# Altium schematic sheet ECG_Schematic.SchDoc
size A4; SheetNumber: 2; SheetTotal: 2
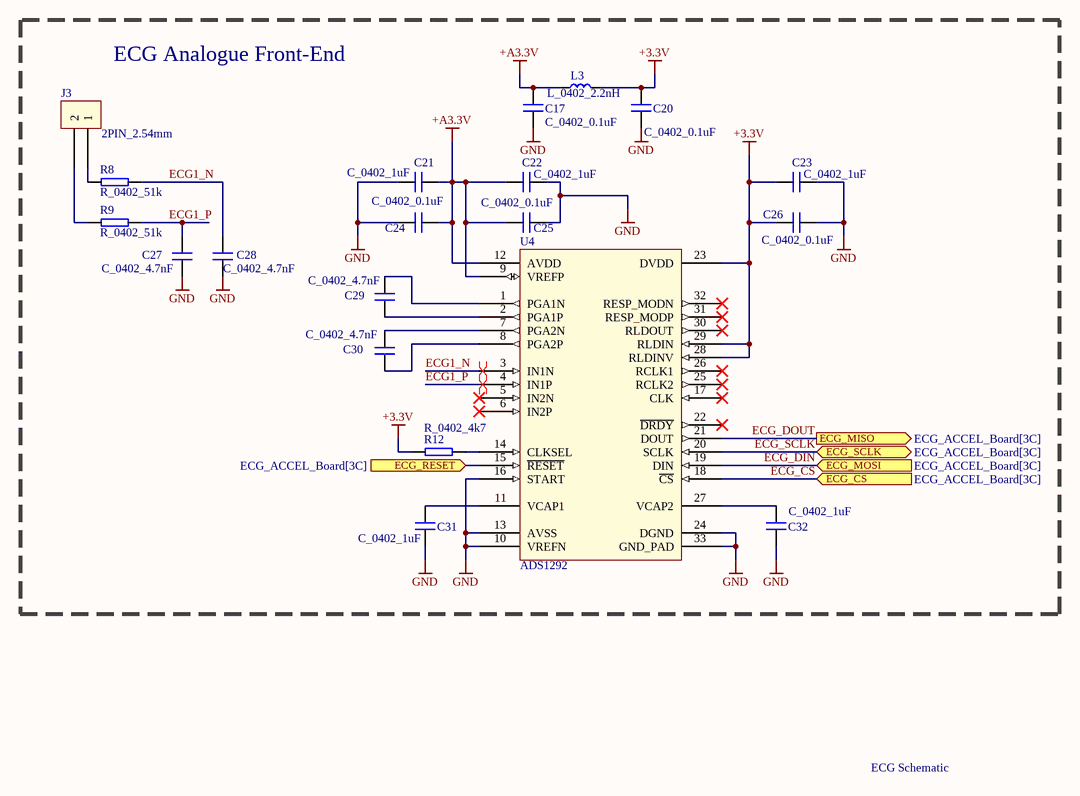
[diagram p0: ECG_Schematic.SchDoc]

## Parts
C17  C_0402_0.1uF  [C_0402]
C20  C_0402_0.1uF  [C_0402]
C21  C_0402_1uF  [C_0402]
C22  C_0402_1uF  [C_0402]
C23  C_0402_1uF  [C_0402]
C24  C_0402_0.1uF  [C_0402]
C25  C_0402_0.1uF  [C_0402]
C26  C_0402_0.1uF  [C_0402]
C27  C_0402_4.7nF  [C_0402]
C28  C_0402_4.7nF  [C_0402]
C29  C_0402_4.7nF  [C_0402]
C30  C_0402_4.7nF  [C_0402]
C31  C_0402_1uF  [C_0402]
C32  C_0402_1uF  [C_0402]
J3  2PIN_2.54mm  [2PIN_2.54mm-Footprint-1]
L3  L_0402_2.2nH  [L_0402]
R8  R_0402_51k  [R_0402]
R9  R_0402_51k  [R_0402]
R12  R_0402_4k7  [R_0402]
U4  ADS1292  [QFN127P600-8N]

## Blocks framed on the sheet
ECG Analogue Front-End: C17 C20-C32 J3 L3 R8 R9 R12 U4

## Ports
ECG_CS (in, see ECG_ACCEL_Board[3C]), ECG_MISO (out, see ECG_ACCEL_Board[3C]), ECG_MOSI (in, see ECG_ACCEL_Board[3C]), ECG_RESET (in, see ECG_ACCEL_Board[3C]), ECG_SCLK (bidir, see ECG_ACCEL_Board[3C])

## Nets
+3.3V: C20.2 C23.1 C26.1 L3.2 R12.2 U4.23(DVDD) U4.28(RLDINV) U4.29(RLDIN)
+A3.3V: C17.2 C21.2 C22.2 C24.2 C25.2 L3.1 U4.9(VREFP) U4.12(AVDD)
GND: C17.1 C20.1 C21.1 C22.1 C23.2 C24.1 C25.1 C26.2 C27.1 C28.1 C31.1 C32.1 U4.10(VREFN) U4.13(AVSS) U4.16(START) U4.24(DGND) U4.33(GND_PAD)
ECG1_N: C28.2 R8.1 U4.3(IN1N)
ECG1_P: C27.2 R9.1 U4.4(IN1P)
ECG_CS: U4.18(~{CS}) ; port ECG_CS
ECG_DIN: U4.19(DIN) ; port ECG_MOSI
ECG_DOUT: U4.21(DOUT) ; port ECG_MISO
ECG_RESET: U4.15(~{RESET}) ; port ECG_RESET
ECG_SCLK: U4.20(SCLK) ; port ECG_SCLK
NetC29_1: C29.1 U4.2(PGA1P)
NetC29_2: C29.2 U4.1(PGA1N)
NetC30_1: C30.1 U4.8(PGA2P)
NetC30_2: C30.2 U4.7(PGA2N)
NetC31_2: C31.2 U4.11(VCAP1)
NetC32_2: C32.2 U4.27(VCAP2)
NetJ3_1: J3.1 R8.2
NetJ3_2: J3.2 R9.2
NetR12_1: R12.1 U4.14(CLKSEL)

Not connected (* = marked no-connect by the designer): U4 5(IN2N)* 6(IN2P)* 17(CLK)* 22(~{DRDY})* 25(RCLK2)* 26(RCLK1)* 30(RLDOUT)* 31(RESP_MODP)* 32(RESP_MODN)*

## Layout directives
differential pair: ECG1_N, ECG1_P

## Notes on the sheet
- ECG Schematic

## Library data of the parts
C17 C20 C24-C26 = CMP-00055-1: JLC Part Number: C1525
C21-C23 C31 C32 = CMP-00053-1: JLC Part Number: C52923
C27-C30 = CMP-00064-1: JLC PArt Number: C1538
J3 = CMP-00018-3: 2 pin power input; JLC Part Number: C5360898
L3 = CMP-00057-1: JLC Part Number: C92035
R8 R9 = CMP-00063-1: JLC Part Number: C25794
R12 = CMP-00050-1: JLC Part Number: C25900
U4 = CMP-00026-5: ECG Analog Front End - AFE 2-Channel,24B ADC; Order Code: 595-ADS1292RIRSMT; Distributor: Mouser; JLC Part Number: C456281